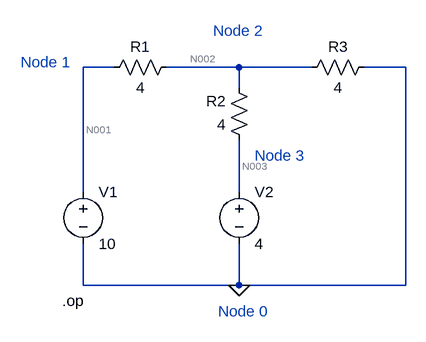
[diagram p0: schematic picture_1.2_schematic.asc]
picture_1.2_schematic.asc, the LTspice schematic file:
Version 4.1
SHEET 1 880 680
WIRE 64 16 16 16
WIRE 256 16 144 16
WIRE 368 16 256 16
WIRE 512 16 448 16
WIRE 256 48 256 16
WIRE 16 208 16 16
WIRE 256 208 256 128
WIRE 16 352 16 288
WIRE 256 352 256 288
WIRE 256 352 16 352
WIRE 512 352 512 16
WIRE 512 352 256 352
FLAG 256 352 0
DATAFLAG 16 112 ""
DATAFLAG 256 16 ""
DATAFLAG 256 352 ""
DATAFLAG 256 160 ""
SYMBOL voltage 16 192 R0
WINDOW 123 0 0 Left 0
WINDOW 39 0 0 Left 0
SYMATTR InstName V1
SYMATTR Value 10
SYMBOL voltage 256 192 R0
WINDOW 123 0 0 Left 0
WINDOW 39 0 0 Left 0
SYMATTR InstName V2
SYMATTR Value 4
SYMBOL res 160 0 R90
WINDOW 0 0 56 VBottom 2
WINDOW 3 32 56 VTop 2
SYMATTR InstName R1
SYMATTR Value 4
SYMBOL res 272 144 R180
WINDOW 0 36 76 Left 2
WINDOW 3 36 40 Left 2
SYMATTR InstName R2
SYMATTR Value 4
SYMBOL res 352 32 R270
WINDOW 0 32 56 VTop 2
WINDOW 3 0 56 VBottom 2
SYMATTR InstName R3
SYMATTR Value 4
TEXT 216 -40 Left 2 ;Node 2
TEXT 224 392 Left 2 ;Node 0
TEXT -80 8 Left 2 ;Node 1
TEXT 280 152 Left 2 ;Node 3
TEXT -16 376 Left 2 !.op

The netlist it stands for:
* picture_1.2_schematic.asc
V1 N001 0 10
V2 N003 0 4
R1 N002 N001 4
R2 N003 N002 4
R3 N002 0 4
* Node 2
* Node 0
* Node 1
* Node 3
.op
.backanno
.end

* Results of the author's LTspice run, read from the files saved beside the schematic
* Operating Point:
*   V(n001) = 10 V
*   V(n002) = 4.667 V
*   V(n003) = 4 V
*   I(R1) = -1.333 A
*   I(R2) = -166.7 mA
*   I(R3) = 1.167 A
*   I(V1) = -1.333 A
*   I(V2) = 166.7 mA